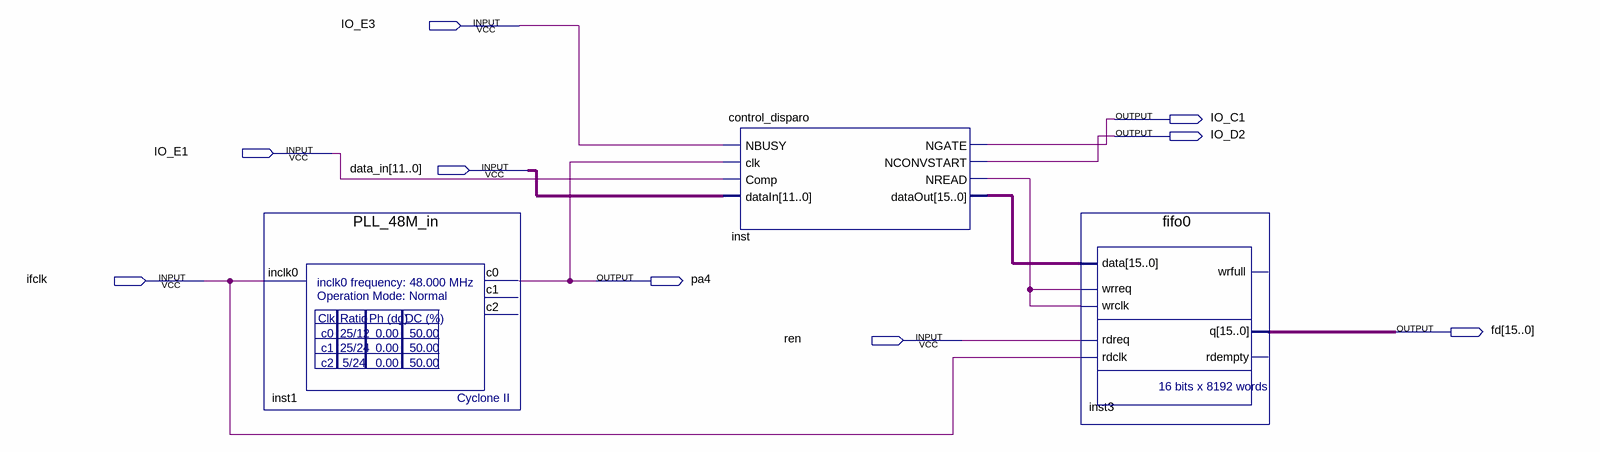
[diagram p0: schematic sheet]
// Quartus schematic Template.bdf as structural Verilog: 3 symbols, 9 pins
module Template (
  input  IO_E3,
  input  IO_E1,
  input  [11:0] data_in,
  input  ifclk,
  input  ren,
  output IO_C1,
  output IO_D2,
  output pa4,
  output [15:0] fd
);

  wire inst_nread;
  wire [15:0] inst_dataout;

  PLL_48M_in inst1 (.inclk0(ifclk), .c0(pa4));  // open: c1, c2
  control_disparo inst (
    .NBUSY(IO_E3), .clk(pa4), .Comp(IO_E1), .dataIn(data_in), .NGATE(IO_C1), .NCONVSTART(IO_D2),
    .NREAD(inst_nread), .dataOut(inst_dataout));
  fifo0 inst3 (
    .data(inst_dataout), .wrreq(inst_nread), .wrclk(inst_nread), .rdreq(ren), .rdclk(ifclk), .q(fd));  // open: wrfull, rdempty
endmodule
